# Altium schematic sheet LedDriver7W.SchDoc
size 209 x 148 mm; DocumentNumber: 1; SheetNumber: 1; SheetTotal: 1
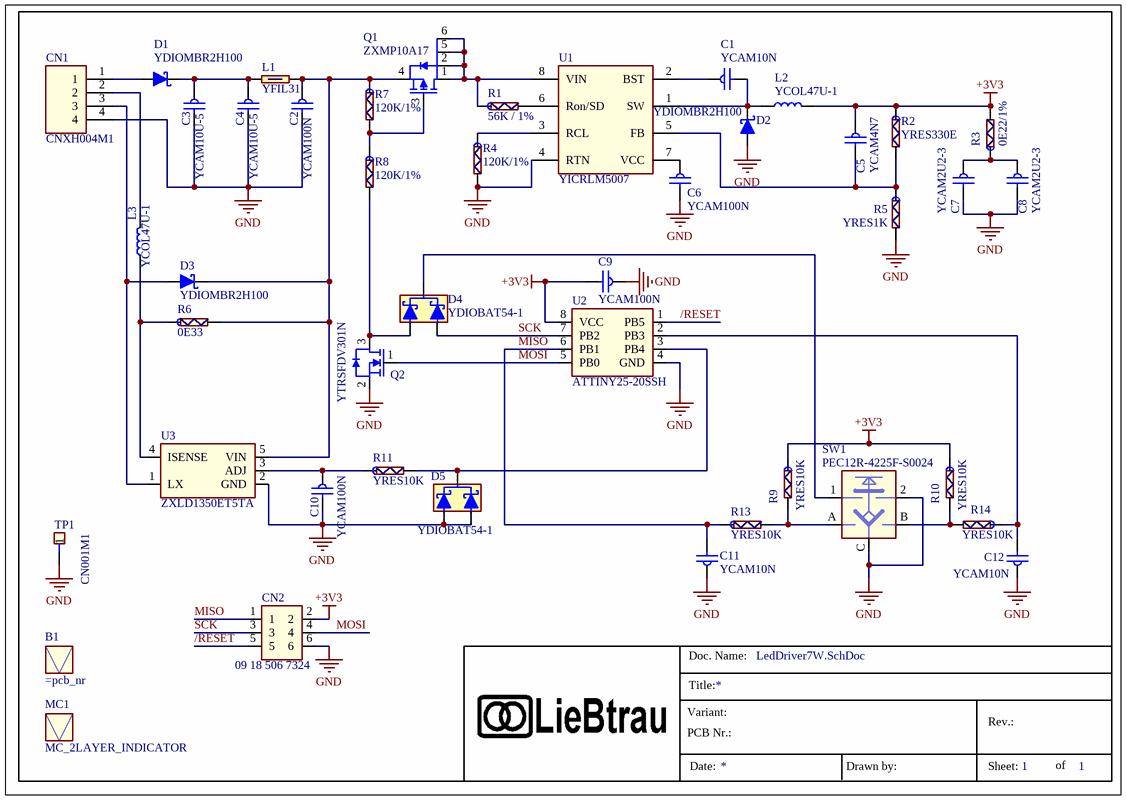
[diagram p0: LedDriver7W.SchDoc]

## Parts
B1  (no value)  [MC_BoardNr]
C1  YCAM10N  [CA_STD1206_H16]
C2  YCAM100N  [CA_STD1206_H16]
C3  YCAM10U-5  [CA_STD1206_H16]
C4  YCAM10U-5  [CA_STD1206_H16]
C5  YCAM4N7  [CA_STD1206_H16]
C6  YCAM100N  [CA_STD1206_H16]
C7  YCAM2U2-3  [CA_STD1206_H16]
C8  YCAM2U2-3  [CA_STD1206_H16]
C9  YCAM100N  [CA_STD1206_H16]
C10  YCAM100N  [CA_STD1206_H16]
C11  YCAM10N  [CA_STD1206_H16]
C12  YCAM10N  [CA_STD1206_H16]
CN1  CNXH004M1  [CN_JST-B4B-XH]
CN2  09 18 506 7324  [CN_HDR2x3_SHROUDED]
D1  YDIOMBR2H100  [DI_SMB]
D2  YDIOMBR2H100  [DI_SMB]
D3  YDIOMBR2H100  [DI_SMB]
D4  YDIOBAT54-1  [SC_SOT23_3P]
D5  YDIOBAT54-1  [SC_SOT23_3P]
L1  YFIL31  [CL_STD1206_H16]
L2  YCOL47U-1  [CL_STD6045]
L3  YCOL47U-1  [CL_STD6045]
MC1  MC_2LAYER_INDICATOR  [MC_2LAYER_INDICATOR]  (no BOM)
Q1  ZXMP10A17  [SC_SOT23_6P]
Q2  YTRSFDV301N  [SC_SOT23_3P]
R1  56K / 1%  [RE_STD1206_H6]
R2  YRES330E  [RE_STD1206_H6]
R3  0E22/1%  [RE_STD1206_H6]
R4  120K/1%  [RE_STD1206_H6]
R5  YRES1K  [RE_STD1206_H6]
R6  0E33  [RE_STD1206_H6]
R7  120K/1%  [RE_STD1206_H6]
R8  120K/1%  [RE_STD1206_H6]
R9  YRES10K  [RE_STD1206_H6]
R10  YRES10K  [RE_STD1206_H6]
R11  YRES10K  [RE_STD1206_H6]
R13  YRES10K  [RE_STD1206_H6]
R14  YRES10K  [RE_STD1206_H6]
SW1  PEC12R-4225F-S0024  [SW_BOURNS_PEC12R]
TP1  CN001M1  [CN_TP_1MM]
U1  YICRLM5007  [SC_MSOP8]
U2  ATTINY25-20SSH  [SC_SO8_M]
U3  ZXLD1350ET5TA  [SC_SOT23_5P]

## Nets
+3V3: C5.1 C9.2 CN2.2 L2.2 R2.1 R3.2 R9.1 R10.1 U2.8(VCC)
GND: C2.2 C3.2 C4.2 C6.2 C7.2 C8.2 C9.1 C10.2 C11.1 C12.1 CN1.4 CN2.6 D2.A D5.1(A1) D5.2(A2) Q2.2(S) R4.2 R5.2 SW1.2 SW1.C TP1.1 U1.4(RTN) U2.4(GND) U3.2(GND)
/RESET: CN2.5 U2.1(PB5)
MISO: C11.2 CN2.1 R13.1 U2.6(PB1)
MOSI: CN2.4 Q2.1(G) U2.5(PB0)
SCK: CN2.3 D4.1(A1) U2.7(PB2)
NetC1_1: C1.1 U1.2(BST)
NetC1_2: C1.2 D2.C L2.1 U1.1(SW)
NetC2_1: C2.1 D3.C L1.2 Q1.4 R6.2 R7.1 U3.5(VIN)
NetC3_1: C3.1 C4.1 D1.C L1.1
NetC5_2: C5.2 R2.2 R5.1 U1.5(FB)
NetC6_1: C6.1 U1.7(VCC)
NetC7_1: C7.1 C8.1 R3.1
NetC10_1: C10.1 R11.1 U3.3(ADJ)
NetC12_2: C12.2 R14.1 U2.2(PB3)
NetCN1_1: CN1.1 D1.A
NetCN1_2: CN1.2 L3.2
NetCN1_3: CN1.3 D3.A U3.1(LX)
NetD4_2: D4.2(A2) Q2.3(D) R8.2
NetD4_3: D4.3(C) SW1.1
NetD5_3: D5.3(C) R11.2 U2.3(PB4)
NetL3_1: L3.1 R6.1 U3.4(ISENSE)
NetQ1_1: Q1.1(G) Q1.2(S) Q1.5 Q1.6 R1.1 U1.8(VIN)
NetQ1_3: Q1.3(D) R7.2 R8.1
NetR1_2: R1.2 U1.6(Ron/SD)
NetR4_1: R4.1 U1.3(RCL)
NetR9_2: R9.2 R13.2 SW1.A
NetR10_2: R10.2 R14.2 SW1.B

## Notes on the sheet
- Title:
- Doc. Name:
- Variant:
- PCB Nr.:
- Rev.:
- Date:
- Drawn by:
- Sheet:
- of

## Library data of the parts
B1 = pcb_nr: Article: pcb_nr; Status: A; Order Code: =PCB_Nr
C1 C11 C12 = YCAM10N: 10N; Sub Category: Ceramic; Order Code: Farnell 1759350; Article: YCAM10N; Category: Capacitor; Status: A
C2 C6 C9 C10 = YCAM100N: 100N; Sub Category: Ceramic; Order Code: Farnell 1759361; Article: YCAM100N; Category: Capacitor; Status: A
C3 C4 = YCAM10U-5: 10U; Sub Category: Ceramic; Order Code: Farnell 1845762; Article: YCAM10U-5; Category: Capacitor; Status: P
C5 = YCAM4N7: 4N7; Sub Category: Ceramic; Order Code: Farnell 1759345; Article: YCAM4N7; Category: Capacitor; Status: A
C7 C8 = YCAM2U2-3: 2U2; Sub Category: Ceramic; Order Code: Farnell 1458911; Article: YCAM2U2-3; Category: Capacitor; Status: A
CN1 = CNXH004M1: HEADER, VERT, 1x4WAY; Sub Category: JST; Order Code: Farnell 1516278; Article: CNXH004M1; Category: Connector; Status: A
CN2 = 09 18 506 7324: HEADER, VERT, N/LATCH, 2x3WAY; Sub Category: IDC; Order Code: Farnell 1097005; Article: 09 18 506 7324; Category: Connector; Status: A
D1-D3 = YDIOMBR2H100: MBRS2H100; Sub Category: Schottky; Order Code: Farnell 9907629; Article: YDIOMBR2H100; Category: Diode; Status: P
D4 D5 = YDIOBAT54-1: BAT54C; Sub Category: Schottky; Order Code: Farnell 1467518; Article: YDIOBAT54-1; Category: Diode; Status: P
L1 = YFIL31: 600E; Sub Category: Beads; Order Code: Farnell 1635757; Article: YFIL31; Category: Inductor; Status: A
L2 L3 = YCOL47U-1: 47UH; Sub Category: Power; Order Code: Farnell 2431544; Article: YCOL47U-1; Category: Inductor; Status: P
Q1 = ZXMP10A17: Sub Category: MOSFET P; Order Code: Farnell 1843776; Article: ZXMP10A17; Category: Transistor; Status: A
Q2 = YTRSFDV301N: FDV301N; Sub Category: MOSFET N; Order Code: Farnell 9845011; Article: YTRSFDV301N; Category: Transistor; Status: P
R1 = 56K / 1%: 56K; Sub Category: Generic; Order Code: Farnell 9236929; Article: 56K / 1%; Category: Resistor; Status: A
R2 = YRES330E: 330E; Sub Category: Generic; Order Code: Farnell 1100177; Article: YRES330E; Category: Resistor; Status: A
R3 = 0E22: Sub Category: Generic; Order Code: Farnell 2328128; Article: 0E22; Category: Resistor; Status: A
R4 R7 R8 = 120K/1%: 120K; Sub Category: Generic; Order Code: Farnell 2139596; Article: 120K/1%; Category: Resistor; Status: A
R5 = YRES1K: 1K; Sub Category: Generic; Order Code: Farnell 1469965; Article: YRES1K; Category: Resistor; Status: A
R6 = 0E33/0,25W: Sub Category: Generic; Order Code: Farnell 2328131; Article: 0E33/0,25W; Category: Resistor; Status: A
R9-R11 R13 R14 = YRES10K: 10K; Sub Category: Generic; Order Code: Farnell 1469970; Article: YRES10K; Category: Resistor; Status: A
SW1 = PEC12R-4225F-S0024: rotary encoder 24 detents, switch; Sub Category: Other; Order Code: RS: 781-6811; Article: PEC12R-4225F-S0024; Category: Switch; Status: A
TP1 = CN001M1: TEST PIN; Sub Category: Other; Article: CN001M1; Category: Connector; Status: A
U1 = YICRLM5007: LM5008AMM/NOPB; Sub Category: SMPS; Order Code: RS 761-5220 / Farnell 1496181; Article: YICRLM5007; Category: IC; Status: P
U2 = ATTINY25-20SSH: Sub Category: Programmable; Order Code: RS 738-0634; Article: ATTINY25-20SSH; Category: IC; Status: A
U3 = ZXLD1350ET5TA: LED driver; Sub Category: SMPS; Order Code: Farnell 1226470; Article: ZXLD1350ET5TA; Category: IC; Status: A
MC1 = MC_2LAYER_INDICATOR: Article: MC_2LAYER_INDICATOR; Status: A